# EAGLE design RainwaterController (EAGLE 9.1.3)
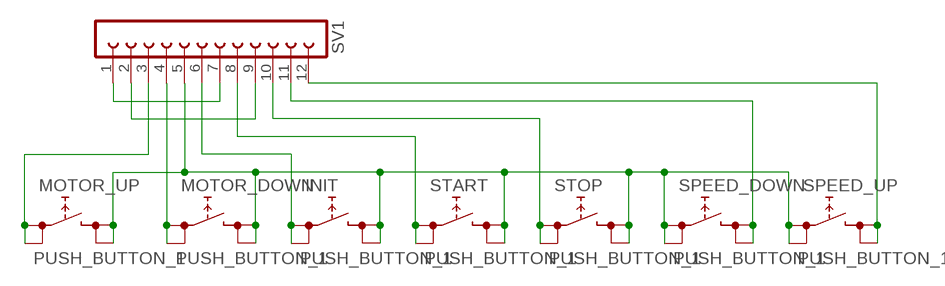
[diagram p0: schematic, sheet 1]

## Parts
INIT  PUSH_BUTTON_1  [PUSHBUTTON]
MOTOR_DOWN  PUSH_BUTTON_1  [PUSHBUTTON]
MOTOR_UP  PUSH_BUTTON_1  [PUSHBUTTON]
SPEED_DOWN  PUSH_BUTTON_1  [PUSHBUTTON]
SPEED_UP  PUSH_BUTTON_1  [PUSHBUTTON]
START  PUSH_BUTTON_1  [PUSHBUTTON]
STOP  PUSH_BUTTON_1  [PUSHBUTTON]
SV1  FE12-1  [FE12]

## Nets
N$1: MOTOR_UP.P$1(P1) MOTOR_UP.P$2(P2) SV1.3
N$2: SV1.1 SV1.7
N$3: INIT.P$3(P3) INIT.P$4(P4) MOTOR_DOWN.P$3(P3) MOTOR_DOWN.P$4(P4) MOTOR_UP.P$3(P3) MOTOR_UP.P$4(P4) SPEED_DOWN.P$1(P1) SPEED_DOWN.P$2(P2) SPEED_UP.P$1(P1) SPEED_UP.P$2(P2) START.P$3(P3) START.P$4(P4) STOP.P$3(P3) STOP.P$4(P4) SV1.5
N$4: SV1.2 SV1.9
N$5: INIT.P$1(P1) INIT.P$2(P2) SV1.6
N$6: START.P$1(P1) START.P$2(P2) SV1.8
N$7: STOP.P$1(P1) STOP.P$2(P2) SV1.10
N$8: MOTOR_DOWN.P$1(P1) MOTOR_DOWN.P$2(P2) SV1.4
N$9: SPEED_DOWN.P$3(P3) SPEED_DOWN.P$4(P4) SV1.11
N$10: SPEED_UP.P$3(P3) SPEED_UP.P$4(P4) SV1.12

## Library data of the parts
INIT MOTOR_DOWN MOTOR_UP SPEED_DOWN SPEED_UP START STOP = rainwater_pushbutton:PUSH_BUTTON_1: Something
SV1 = con-lsta:FE12-1: FEMALE HEADER; OC_FARNELL: unknown; OC_NEWARK: unknown

## Board
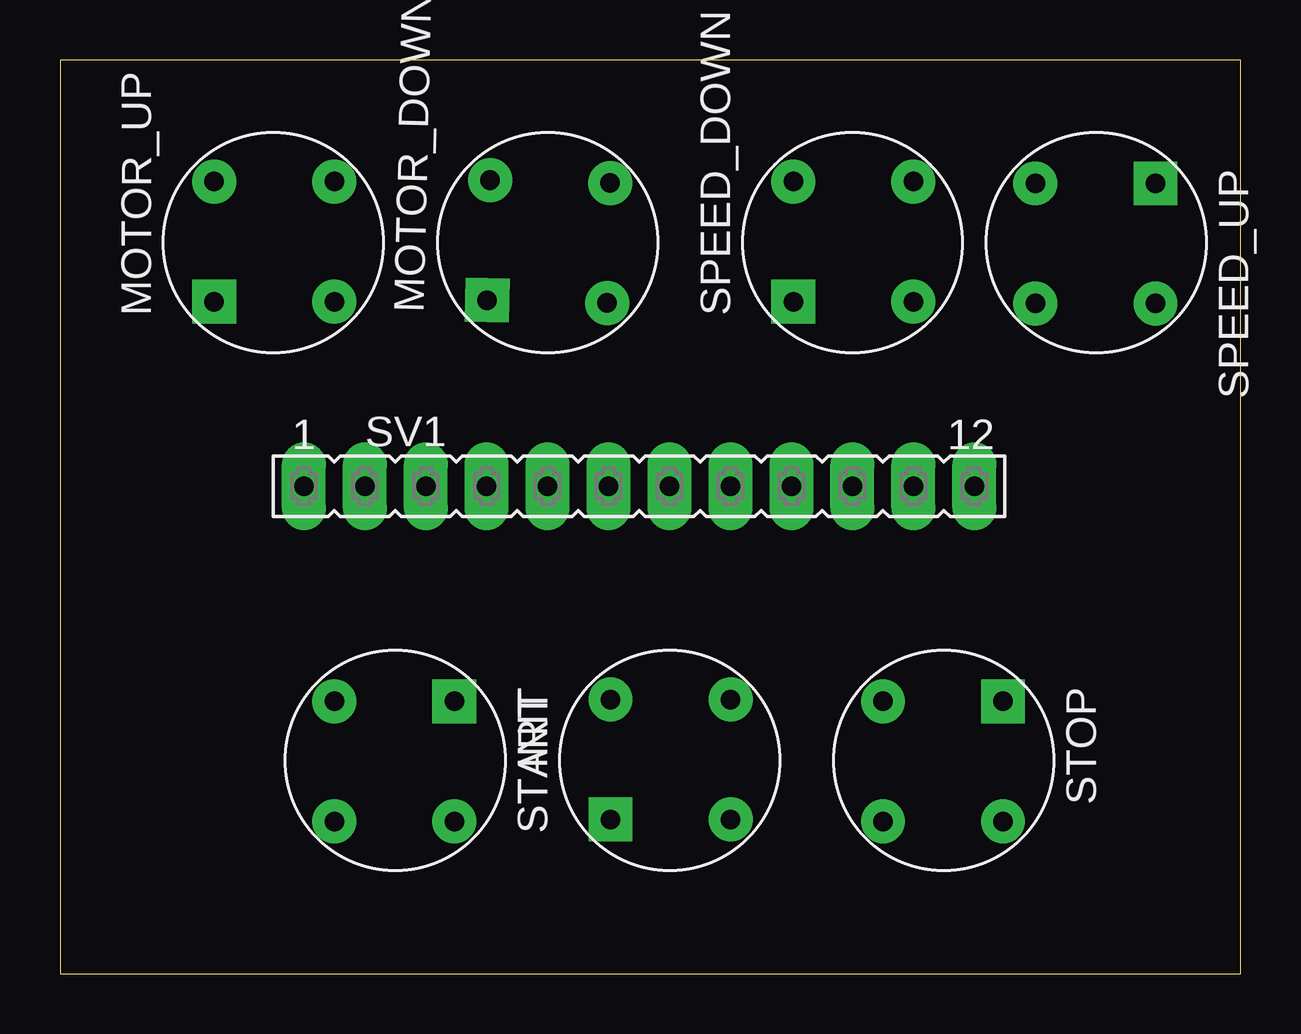
[diagram p1: board, top side]
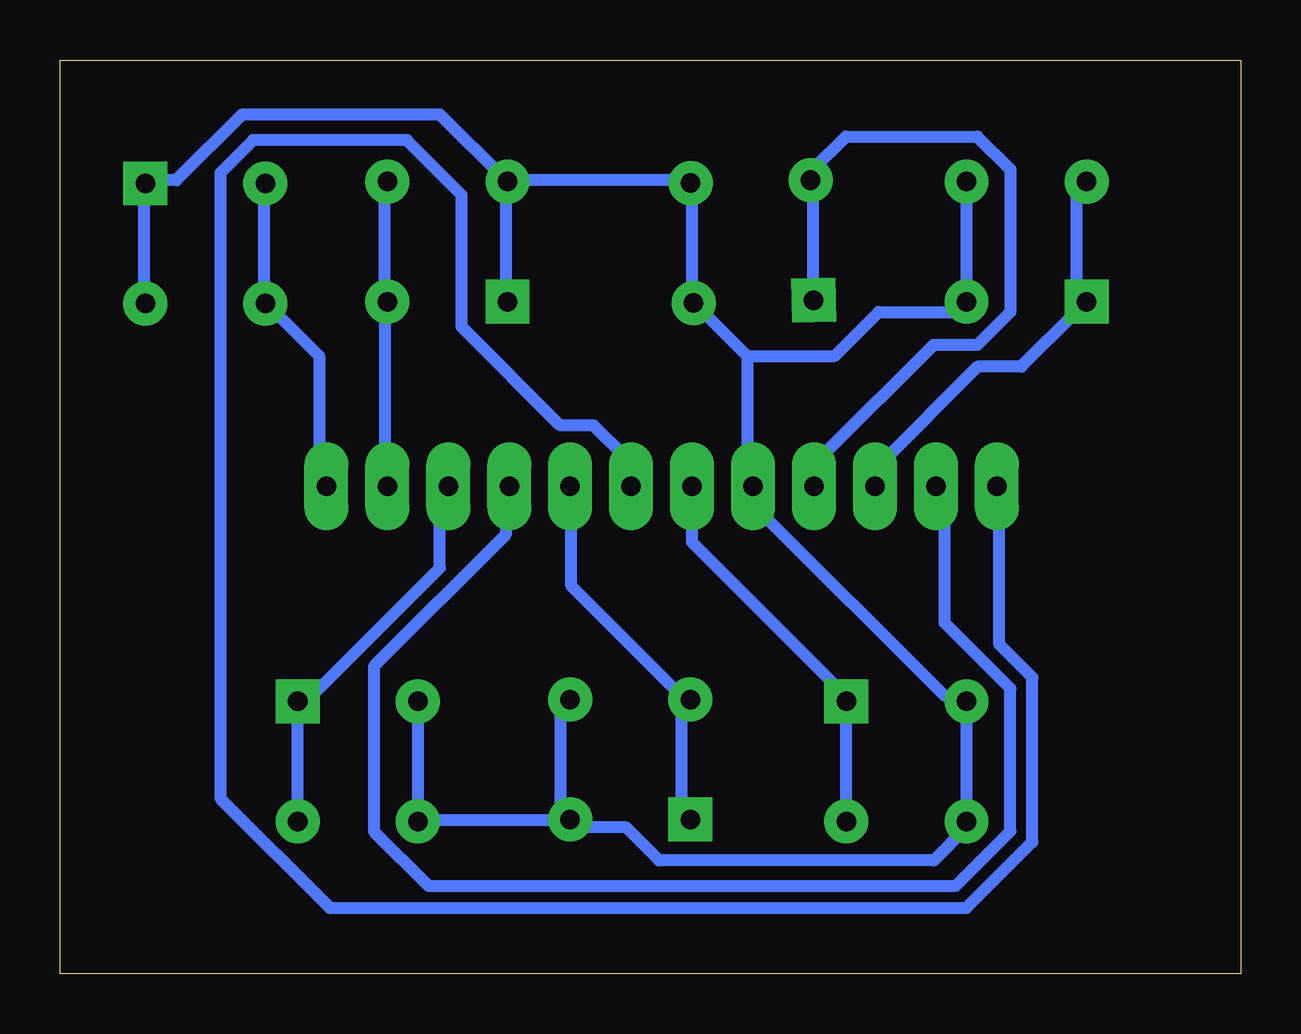
[diagram p2: board, bottom side, seen from below]

Size 49.2 x 38.09 mm. Coordinates in mm from the lower left corner, seen from the top.
Outline: 0,0 49.2,0 49.2,38.09 0,38.09 0,0
Copper layers (1*16): Top 0mil / dielectric 1.5mm / Bottom 0.035mm
Design rules "tad265_drc": minimum track width 20mil, minimum drill 0.35mm, track to track 16mil, track to pad 16mil, pad to pad 16mil, via to via 16mil, smd to smd 16mil, copper to edge 60mil, drill to drill 16mil, minimum pad ring 20mil, minimum via ring 15mil, stop-mask expansion 8mil, vias tented up to drill 0mil, thermal gap 20mil

### Footprints (pad centres in the part's own frame; a part is rotated, then mirrored left to right if it is on the bottom)
PUSHBUTTON = drill 0.813 pad 1.778 square: P$1 -2.464,2.464 | drill 0.813 pad 1.778: P$2 2.54,2.464; P$3 2.54,-2.54; P$4 -2.464,-2.54
FE12 = drill 0.813 long: 1 -13.97,0; 2 -11.43,0; 3 -8.89,0; 4 -6.35,0; 5 -3.81,0; 6 -1.27,0; 7 1.27,0; 8 3.81,0; 9 6.35,0; 10 8.89,0; 11 11.43,0; 12 13.97,0

### Placement (x,y rotation side)
INIT  13.97,8.89 270 top
MOTOR_DOWN  20.32,30.48 88.6 top
MOTOR_UP  8.89,30.48 90 top
SPEED_DOWN  33.02,30.48 90 top
SPEED_UP  43.18,30.48 270 top
START  25.4,8.89 90 top
STOP  36.83,8.89 270 top
SV1  24.13,20.32 0 top

### Tracks (layer width: path | path; a pad name or v marks a point on that pad's centre or on a via)
N$1
  Bottom 0.508: MOTOR_UP.P$2 6.86,32.61 6.86,28.04 MOTOR_UP.P$1 6.86,27.58 9.14,25.3 10.97,25.3 15.09,21.18 15.09,20.73 SV1.3
N$2
  Bottom 0.508: SV1.1 10.06,20.12 10.06,13.72 8.69,12.34 8.69,5.49 11.43,2.74 37.95,2.74 42.52,7.32 42.52,33.38 41.15,34.75 34.75,34.75 32.46,32.46 32.46,26.98 28.35,22.86 26.98,22.86 25.6,21.49 25.6,20.57 SV1.7
N$3
  Bottom 0.508: START.P$4 28.35,6.55 28.35,11.12 START.P$3 | SPEED_UP.P$2 45.72,28.04 45.72,32.61 SPEED_UP.P$1 45.26,33.07 44.35,33.07 41.6,35.81 33.38,35.81 30.63,33.07 SPEED_DOWN.P$2 | SPEED_DOWN.P$1 30.63,28.04 30.63,32.61 SPEED_DOWN.P$2 | MOTOR_UP.P$3 11.43,32.61 11.43,28.04 MOTOR_UP.P$4 11.43,27.58 15.09,27.58 16.92,25.76 20.57,25.76 | 20.57,25.76 20.57,20.73 SV1.5 20.12,20.27 20.12,19.36 12.34,11.58 11.43,11.58 INIT.P$4 11.43,11.12 11.43,6.55 INIT.P$3 11.43,6.1 12.8,4.72 24.23,4.72 25.6,6.1 27.89,6.1 START.P$4 | 20.57,25.76 22.4,27.58 MOTOR_DOWN.P$4 22.86,28.04 22.86,32.61 MOTOR_DOWN.P$3 23.32,33.07 30.18,33.07 SPEED_DOWN.P$2 | 34.29,6.4 34.29,10.97 STOP.P$4 | 34.29,6.4 STOP.P$3 34.29,6.4 | 34.29,6.4 28.35,6.4 START.P$4
N$4
  Bottom 0.508: 30.63,20.27 SV1.9 30.63,20.12 30.63,18.29 36.12,12.8 36.12,5.94 33.83,3.66 11.89,3.66 9.6,5.94 9.6,11.89 12.34,14.63 12.34,20.12 SV1.2
N$5
  Bottom 0.508: INIT.P$2 16.46,6.55 16.46,11.12 INIT.P$1 16.46,11.58 22.86,17.98 22.86,20.27 SV1.6
N$6
  Bottom 0.508: START.P$1 23.32,6.55 23.32,11.12 START.P$2 23.32,11.58 27.89,16.15 27.89,20.27 SV1.8
N$7
  Bottom 0.508: 33.38,20.27 SV1.10 33.38,20.12 33.38,16.92 38.86,11.43 STOP.P$1 39.32,10.97 39.32,6.4 STOP.P$2
N$8
  Bottom 0.508: SV1.4 17.37,20.73 17.37,21.64 12.8,26.21 10.97,26.21 9.6,27.58 9.6,33.53 10.97,34.9 16.46,34.9 17.83,33.53 MOTOR_DOWN.P$2 17.83,33.07 17.83,28.5 MOTOR_DOWN.P$1
N$9
  Bottom 0.508: SV1.11 35.66,20.73 35.66,27.58 SPEED_DOWN.P$4 35.66,28.04 35.66,32.61 SPEED_DOWN.P$3
N$10
  Bottom 0.508: SV1.12 38.41,20.73 38.41,25.76 40.23,27.58 SPEED_UP.P$3 40.69,28.04 40.69,32.61 SPEED_UP.P$4